# EAGLE design pu (EAGLE 7.6.0)
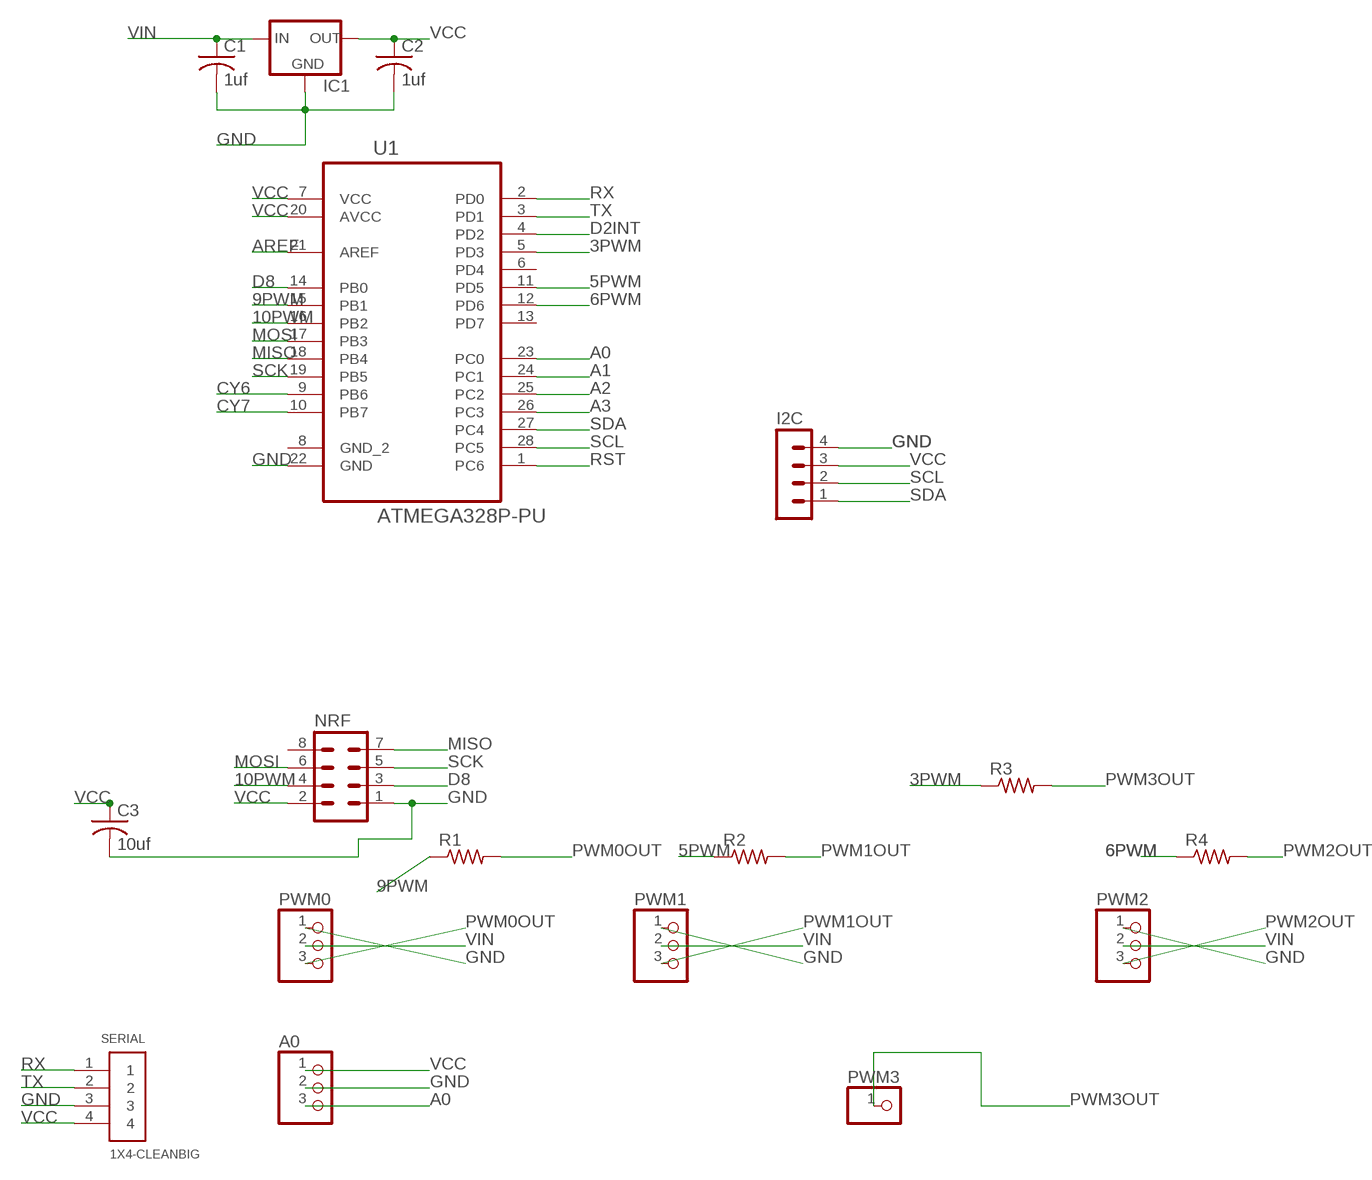
[diagram p0: schematic, sheet 1]

## Parts
A0  PINHD-1X3  [1X03]
C1  1uf  C-US025-025X050  [C025-025X050]
C2  1uf  C-US025-025X050  [C025-025X050]
C3  10uf  C-US025-025X050  [C025-025X050]
I2C  MA04-1  [MA04-1]
IC1  MCP1700TRI  [TO92]
NRF  MA04-2  [MA04-2]
PWM0  PINHD-1X3  [1X03]
PWM1  PINHD-1X3  [1X03]
PWM2  PINHD-1X3  [1X03]
PWM3  PINHD-1X1CB  [1X01-CLEANBIG]
R1  R-US_0204/5  [0204/5]
R2  R-US_0204/5  [0204/5]
R3  R-US_0204/5  [0204/5]
R4  R-US_0204/5  [0204/5]
SERIAL  1X4-CLEANBIG  [1X04-CLEANBIG]
U1  ATMEGA328P-PU  [DIP254P762X457-28]

## Nets
3PWM: R3.1 U1.5(PD3)
5PWM: R2.1 U1.11(PD5)
6PWM: R4.1 U1.12(PD6)
9PWM: R1.1 U1.15(PB1)
10PWM: NRF.4 U1.16(PB2)
A0: A0.3 U1.23(PC0)
A1: U1.24(PC1)
A2: U1.25(PC2)
A3: U1.26(PC3)
AREF: U1.21(AREF)
CY6: U1.9(PB6)
CY7: U1.10(PB7)
D2INT: U1.4(PD2)
D8: NRF.3 U1.14(PB0)
GND: A0.2 C1.2 C2.2 C3.2 I2C.4 IC1.1(GND) NRF.1 PWM0.1 PWM1.1 PWM2.1 SERIAL.3 U1.22(GND)
MISO: NRF.7 U1.18(PB4)
MOSI: NRF.6 U1.17(PB3)
PWM0OUT: PWM0.3 R1.2
PWM1OUT: PWM1.3 R2.2
PWM2OUT: PWM2.3 R4.2
PWM3OUT: PWM3.1 R3.2
RST: U1.1(PC6)
RX: SERIAL.1 U1.2(PD0)
SCK: NRF.5 U1.19(PB5)
SCL: I2C.2 U1.28(PC5)
SDA: I2C.1 U1.27(PC4)
TX: SERIAL.2 U1.3(PD1)
VCC: A0.1 C2.1 C3.1 I2C.3 IC1.3(OUT) NRF.2 SERIAL.4 U1.7(VCC) U1.20(AVCC)
VIN: C1.1 IC1.2(IN) PWM0.2 PWM1.2 PWM2.2
Unconnected: NRF.8 U1.6(PD4) U1.8(GND_2) U1.13(PD7)

## Library data of the parts
A0 PWM0 PWM1 PWM2 = adafruit:PINHD-1X3: PIN HEADER
C1-C3 = adafruit:C-US: CAPACITOR, American symbol
I2C = con-lstb:MA04-1: PIN HEADER; OC_FARNELL: unknown; OC_NEWARK: unknown
IC1 = adafruit:MCP1700: VOLTAGE REGULATOR
NRF = con-lstb:MA04-2: PIN HEADER; OC_FARNELL: unknown; OC_NEWARK: unknown
PWM3 = adafruit:PINHD-1X1: Pin header 1x1 for 0.1" spacing With round pins
R1-R4 = resistor:R-US_: RESISTOR, American symbol
SERIAL = adafruit:1X4: 4-pin connector
U1 = Atmel_By_element14_Batch_1-00:ATMEGA328P-PU: 8-bit Microcontroller with In-System Programmable Flash; MPN: ATMEGA328P-PU; OC_FARNELL: 1715487; OC_NEWARK: 15R0268; PACKAGE: PDIP-28; SUPPLIER: Atmel

## Board
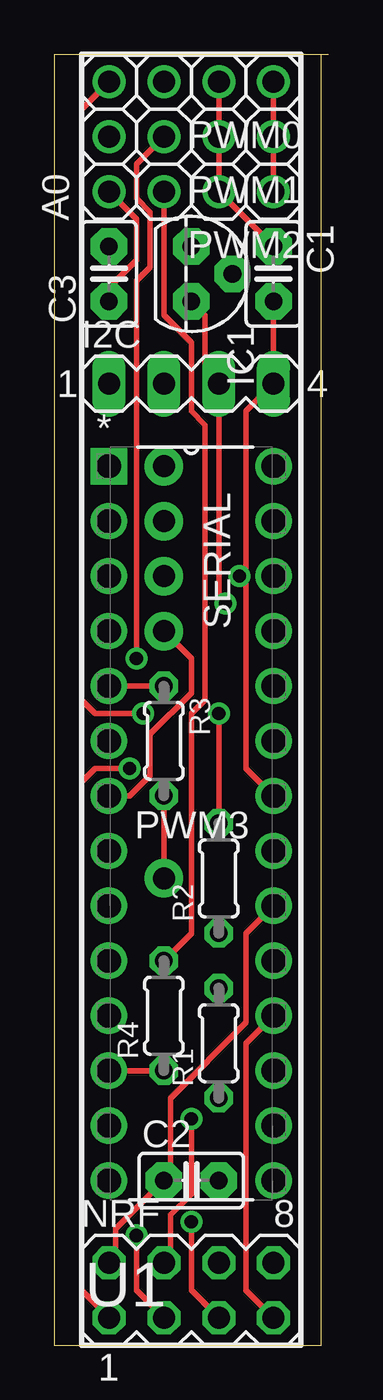
[diagram p1: board, top side]
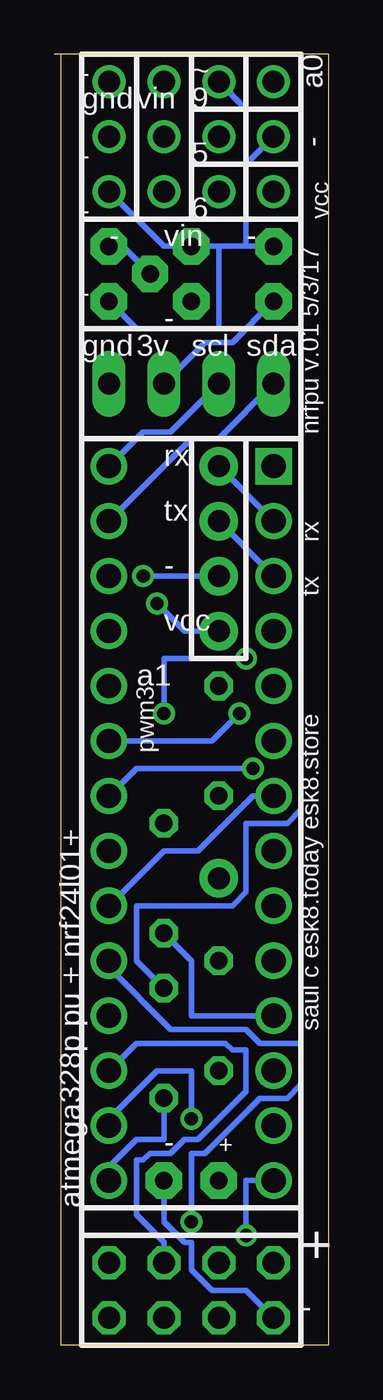
[diagram p2: board, bottom side, seen from below]

Size 12.7 x 59.69 mm. Coordinates in mm from the lower left corner, seen from the top.
Outline: 12.37,59.68 12.37,0 0,0 0,59.69 12.7,59.69
Copper layers (1*16): Top 0.035mm / dielectric 1.5mm / Bottom 0.035mm
Design rules "default": minimum track width 10mil, minimum drill 24mil, track to track 8mil, track to pad 8mil, pad to pad 8mil, via to via 8mil, smd to smd 8mil, copper to edge 40mil, drill to drill 8mil, minimum pad ring 10mil, minimum via ring 8mil, stop-mask expansion 4mil, vias tented up to drill 0mil, thermal gap 10mil

### Footprints (pad centres in the part's own frame; a part is rotated, then mirrored left to right if it is on the bottom)
1X03 = drill 1.016: 1 -2.54,0; 2 0,0; 3 2.54,0
C025-025X050 = drill 0.813 pad 1.676 octagon: 1 -1.27,0; 2 1.27,0
MA04-1 = drill 1.016 long: 1 -3.81,0; 2 -1.27,0; 3 1.27,0; 4 3.81,0
TO92 = drill 0.813 pad 1.676 octagon: 1 -1.27,0; 2 0,1.905; 3 1.27,0
MA04-2 = drill 1.016 octagon: 1 -3.81,-1.27; 2 -3.81,1.27; 3 -1.27,-1.27; 4 -1.27,1.27; 5 1.27,-1.27; 6 1.27,1.27; 7 3.81,-1.27; 8 3.81,1.27
1X01-CLEANBIG = drill 1.016 pad 1.778: 1 0,0
0204/5 = drill 0.813 octagon: 1 -2.54,0; 2 2.54,0
1X04-CLEANBIG = drill 1.016 pad 1.778: 1 -3.81,0; 2 -1.27,0; 3 1.27,0; 4 3.81,0
DIP254P762X457-28 = drill 1.118 square: 1 -7.62,33.02 | drill 1.118: 2 -7.62,30.48; 3 -7.62,27.94; 4 -7.62,25.4; 5 -7.62,22.86; 6 -7.62,20.32; 7 -7.62,17.78; 8 -7.62,15.24; 9 -7.62,12.7; 10 -7.62,10.16; 11 -7.62,7.62; 12 -7.62,5.08; 13 -7.62,2.54; 14 -7.62,0; 15 0,0; 16 0,2.54; 17 0,5.08; 18 0,7.62; 19 0,10.16; 20 0,12.7; 21 0,15.24; 22 0,17.78; 23 0,20.32; 24 0,22.86; 25 0,25.4; 26 0,27.94; 27 0,30.48; 28 0,33.02

### Placement (x,y rotation side)
A0  2.54,55.88 90 top
C1  10.16,49.53 270 top
C2  6.35,7.62 0 top
C3  2.54,49.53 90 top
I2C  6.35,44.45 0 top
IC1  6.35,49.53 270 top
NRF  6.35,2.54 0 top
PWM0  7.62,58.42 180 top
PWM1  7.62,55.88 180 top
PWM2  7.62,53.34 180 top
PWM3  5.08,21.59 0 top
R1  7.62,13.97 90 top
R2  7.62,21.59 90 top
R3  5.08,27.94 270 top
R4  5.08,15.24 90 top
SERIAL  5.08,36.83 270 top
U1  10.16,7.62 0 top

### Tracks (layer width: path | path; a pad name or v marks a point on that pad's centre or on a via)
3PWM
  Top 0.254: U1.5 R3.1
5PWM
  Bottom 0.254: R2.1 6.35,17.78 6.35,15.24 U1.11
6PWM
  Top 0.254: U1.12 R4.1
9PWM
  Bottom 0.254: R1.1 7.62,9.53 8.89,9.53 10.16,8.26 U1.15
10PWM  (via drill 0.61)
  Top 0.254: NRF.4 5.4,4.13 5.4,6.03 6.35,6.99 v6.35,10.48
  Bottom 0.254: v6.35,10.48 6.35,12.7 7.94,12.7 10.16,10.48 U1.16
A0  (via drill 0.61)
  Top 0.254: A0.3 1.27,57.15 1.27,29.84 1.9,29.21 v4.13,29.21
  Bottom 0.254: v4.13,29.21 5.4,27.94 U1.23
D8  (via drill 0.61)
  Top 0.254: NRF.3 3.81,2.54 v3.81,5.08
  Bottom 0.254: v3.81,5.08 3.81,7.62 U1.14
GND  (via drill 0.61)
  Top 0.254: PWM2.1 PWM1.1 PWM0.1 | C1.2 I2C.4 8.89,43.18 8.89,35.56 | U1.22 8.89,26.67 8.89,35.56 | 8.89,35.56 v8.57,35.56 | NRF.1 1.27,2.54 1.27,26.04 1.9,26.67 v3.49,26.67
  Bottom 0.254: A0.2 3.81,54.61 3.81,50.8 | C3.2 3.81,50.8 | 3.81,50.8 5.08,50.8 | 5.08,50.8 IC1.1 7.62,50.8 PWM2.1 | NRF.1 3.81,2.54 5.4,2.54 6.35,3.49 6.35,4.76 6.67,4.76 7.62,5.71 C2.2 | v8.57,35.56 SERIAL.3 | v3.49,26.67 8.89,26.67 U1.22 | 5.08,50.8 5.08,46.99 8.89,46.99 C1.2
MISO
  Top 0.254: NRF.7 8.89,2.54 8.89,13.97 U1.18
MOSI
  Bottom 0.254: NRF.6 7.62,4.76 8.89,6.03 8.89,8.57 8.57,8.57 8.26,8.89 7.3,8.89 6.67,9.53 6.03,9.53 3.81,11.75 3.81,13.65 4.45,13.65 4.76,13.97 8.89,13.97 U1.17
PWM0OUT
  Bottom 0.254: R1.2 8.89,17.78 8.89,20.32 4.45,20.32 3.81,20.95 3.81,24.13 1.9,24.13 1.27,24.77 1.27,57.15 3.81,57.15 PWM0.3
PWM1OUT  (via drill 0.61)
  Top 0.254: v7.62,29.21 R2.2 | v3.81,31.75 3.81,49.21 4.45,49.85 4.45,52.39 3.81,53.02 3.81,54.61 PWM1.3
  Bottom 0.254: v7.62,29.21 7.62,31.75 v3.81,31.75
PWM2OUT
  Top 0.254: R4.2 6.35,19.05 6.35,29.21 6.99,29.84 6.99,42.55 6.35,43.18 6.35,46.35 5.08,47.62 PWM2.3
PWM3OUT
  Top 0.254: PWM3.1 R3.2
RX
  Bottom 0.254: SERIAL.1 U1.2
SCK  (via drill 0.61)
  Top 0.254: NRF.5 6.35,2.54 v6.35,5.71
  Bottom 0.254: v6.35,5.71 6.35,8.89 5.71,8.89 3.18,11.43 1.9,11.43 1.27,12.06 1.27,13.97 3.18,13.97 3.81,14.61 7.3,14.61 10.16,17.46 U1.19
SCL
  Bottom 0.254: I2C.2 7.3,42.23 8.57,42.23 U1.28
SDA
  Bottom 0.254: I2C.1 5.08,41.91 6.35,41.91 U1.27
TX
  Bottom 0.254: SERIAL.2 U1.3
VCC  (via drill 0.61)
  Top 0.254: IC1.3 6.99,47.62 6.99,45.09 I2C.3 7.62,34.61 v7.94,34.29 | A0.1 3.81,52.07 3.81,50.16 2.54,48.9 C3.1 | NRF.2 2.86,4.13 2.86,5.4 C2.1 5.4,7.94 5.4,11.43 8.89,14.92 8.89,19.05 U1.20 | SERIAL.4 6.35,31.75 6.35,30.16 4.45,28.26 4.45,26.35 3.49,25.4 U1.7
  Bottom 0.254: I2C.3 5.71,46.35 4.45,46.35 C3.1 | U1.20 7.62,22.86 6.03,22.86 3.49,25.4 U1.7 | v7.94,34.29 6.67,33.02 SERIAL.4
VIN
  Top 0.254: PWM0.2 PWM1.2 PWM2.2 C1.1
  Bottom 0.254: IC1.2 9.53,50.8 C1.1

### Text on the board
Unrouted: + | - | -
bPlace: a0 | ~ | - | 9 | vin | gnd | - | 5 | - | vcc | 6 | - | nrfpu v.01 5/3/17 | - | vin | - | - | - | sda | scl | 3v | gnd | rx | rx | tx | tx | - | vcc | a1 | pwm3 | saul c esk8.today esk8.store | + | - | atmega328p pu + nrf24l01+ | + | -